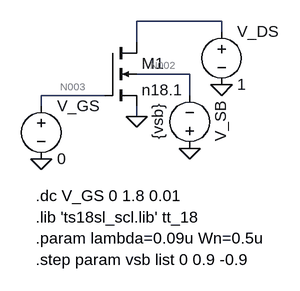
[diagram p0: schematic q1.asc]
q1.asc, the LTspice schematic file:
Version 4.1
SHEET 1 880 680
WIRE 272 -64 144 -64
WIRE 272 -48 272 -64
WIRE 144 -32 144 -64
WIRE 224 16 144 16
WIRE 96 48 0 48
WIRE 224 48 224 16
WIRE 0 64 0 48
WIRE 144 80 144 64
FLAG 0 144 0
FLAG 272 32 0
FLAG 144 80 0
FLAG 224 128 0
SYMBOL voltage 0 48 R0
WINDOW 123 0 0 Left 0
WINDOW 39 0 0 Left 0
SYMATTR InstName V_GS
SYMATTR Value 0
SYMBOL voltage 272 -64 R0
WINDOW 123 0 0 Left 0
WINDOW 39 0 0 Left 0
SYMATTR InstName V_DS
SYMATTR Value 1
SYMBOL nmos4 96 -32 R0
SYMATTR InstName M1
SYMATTR Value n18.1
SYMATTR Value2 l={2*lambda} w={Wn} ad={5*lambda*Wn} as={5*lambda*Wn} pd={2*Wn + 10*lambda} ps={2*Wn + 10*lambda}
SYMBOL voltage 224 144 R180
WINDOW 0 -32 56 VBottom 2
WINDOW 3 32 56 VTop 2
WINDOW 123 0 0 Left 0
WINDOW 39 0 0 Left 0
SYMATTR InstName V_SB
SYMATTR Value {vsb}
TEXT -8 200 Left 2 !.dc V_GS 0 1.8 0.01
TEXT -8 264 Left 2 !.param lambda=0.09u Wn=0.5u
TEXT -8 232 Left 2 !.lib 'ts18sl_scl.lib' tt_18
TEXT -8 296 Left 2 !.step param vsb list 0 0.9 -0.9

The netlist it stands for:
* q1.asc
V_GS N003 0 0
V_DS N001 0 1
M1 N001 N003 0 N002 n18.1 l={2*lambda} w={Wn} ad={5*lambda*Wn} as={5*lambda*Wn} pd={2*Wn + 10*lambda} ps={2*Wn + 10*lambda}
V_SB 0 N002 {vsb}
.model NMOS NMOS
.model PMOS PMOS
.lib standard.mos
.dc V_GS 0 1.8 0.01
.param lambda=0.09u Wn=0.5u
.lib 'ts18sl_scl.lib' tt_18
.step param vsb list 0 0.9 -0.9
.backanno
.end

* Results of the author's LTspice run, read from the files saved beside the schematic
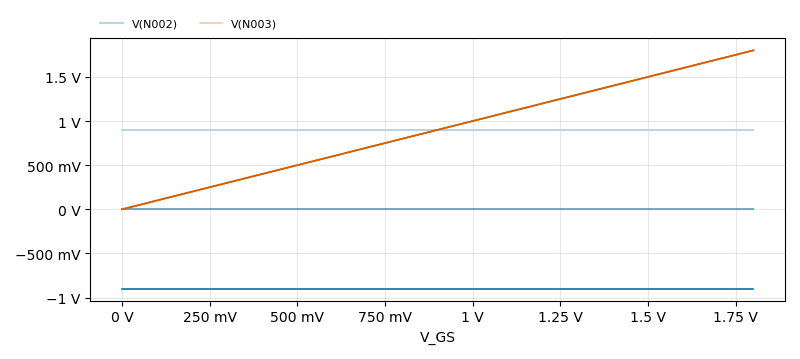
[diagram p1: DC transfer characteristic of q1.asc, plotted from the saved traces]
* DC transfer characteristic, 3 runs:
*   V(N002) [vsb=-0.9]: 900 mV at V_GS=0 V, 900 mV at V_GS=1.8 V, min 900 mV, max 900 mV
*   V(N002) [vsb=0]: 0 V at V_GS=0 V, 0 V at V_GS=1.8 V, min 0 V, max 0 V
*   V(N002) [vsb=0.9]: -900 mV at V_GS=0 V, -900 mV at V_GS=1.8 V, min -900 mV, max -900 mV
*   V(N003) [vsb=-0.9]: 0 V at V_GS=0 V, 1.8 V at V_GS=1.8 V, min 0 V, max 1.8 V
*   V(N003) [vsb=0]: 0 V at V_GS=0 V, 1.8 V at V_GS=1.8 V, min 0 V, max 1.8 V
*   V(N003) [vsb=0.9]: 0 V at V_GS=0 V, 1.8 V at V_GS=1.8 V, min 0 V, max 1.8 V